# EAGLE design Low Noise PS (EAGLE 6.6.0)
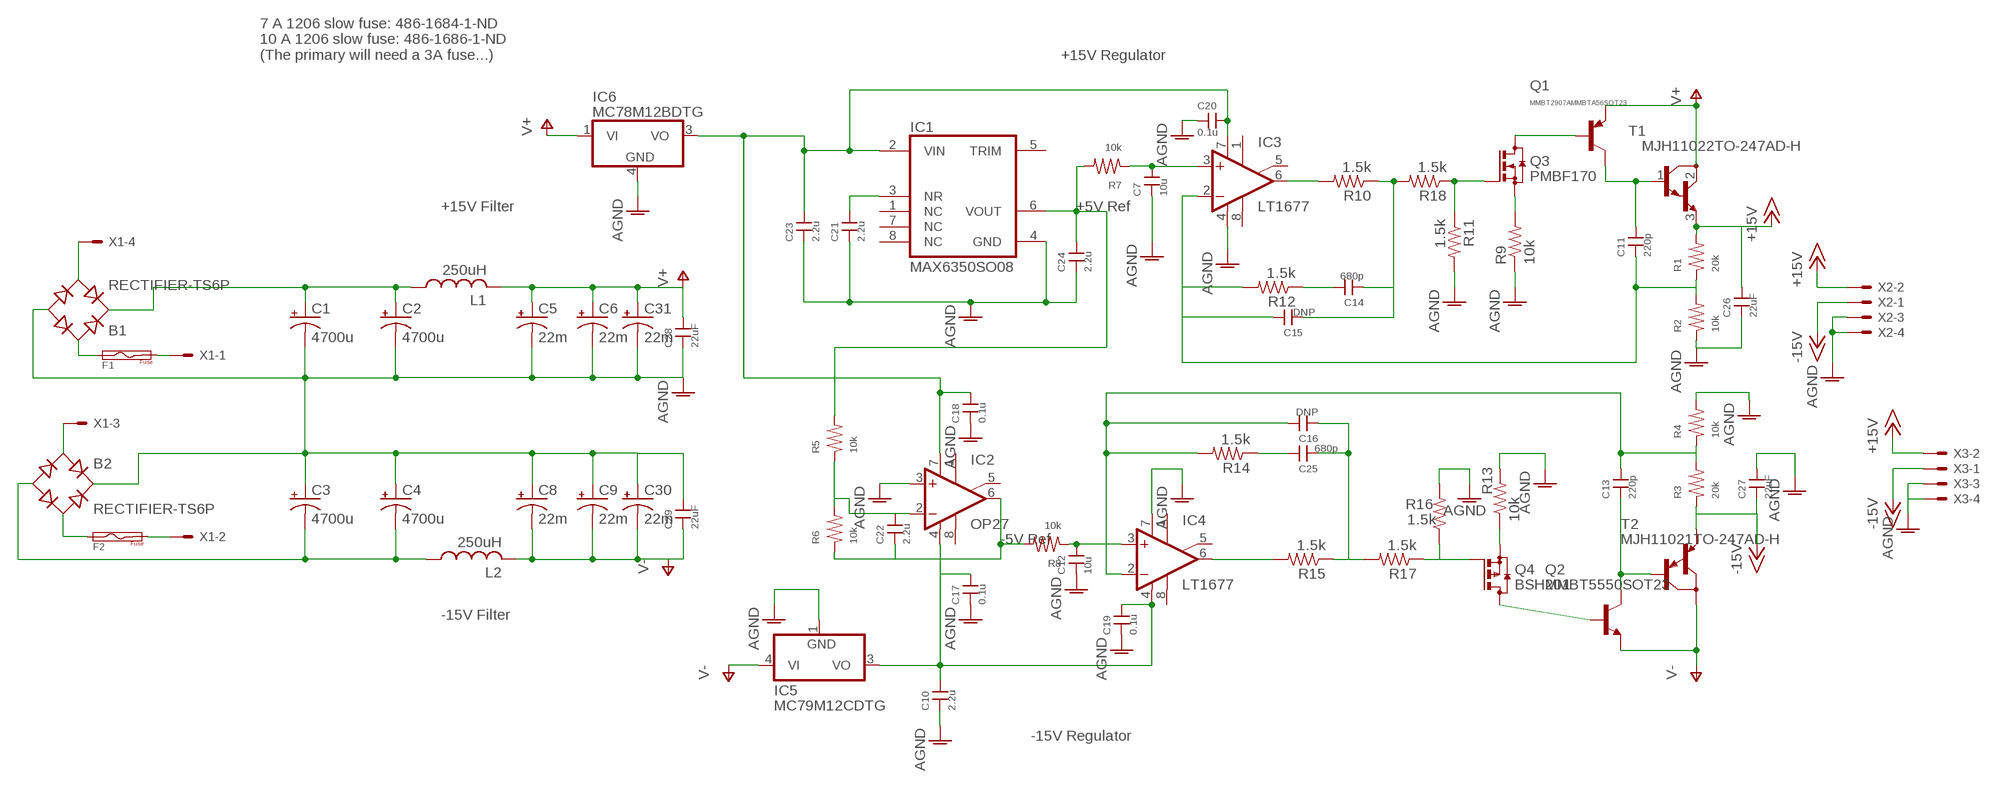
[diagram p0: schematic, sheet 1]

## Parts
B1  RECTIFIER-TS6P  [TS6P]
B2  RECTIFIER-TS6P  [TS6P]
C1  4700u  CPOL-USE7.5-18  [E7,5-18]
C2  4700u  CPOL-USE7.5-18  [E7,5-18]
C3  4700u  CPOL-USE7.5-18  [E7,5-18]
C4  4700u  CPOL-USE7.5-18  [E7,5-18]
C5  22m  CPOL-USEB35D  [EB35D]
C6  22m  CPOL-USEB35D  [EB35D]
C7  10u  CAP1206  [1206]
C8  22m  CPOL-USEB35D  [EB35D]
C9  22m  CPOL-USEB35D  [EB35D]
C10  2.2u  CAP1206  [1206]
C11  220p  CAP1206  [1206]
C12  10u  CAP1206  [1206]
C13  220p  CAP1206  [1206]
C14  680p  CAP1206  [1206]
C15  DNP  CAP1206  [1206]
C16  DNP  CAP1206  [1206]
C17  0.1u  CAP1206  [1206]
C18  0.1u  CAP1206  [1206]
C19  0.1u  CAP1206  [1206]
C20  0.1u  CAP1206  [1206]
C21  2.2u  CAP1206  [1206]
C22  2.2u  CAP1206  [1206]
C23  2.2u  CAP1206  [1206]
C24  2.2u  CAP1206  [1206]
C25  680p  CAP1206  [1206]
C26  22uF  CAP1206  [1206]
C27  22uF  CAP1206  [1206]
C28  22uF  CAP1206  [1206]
C29  22uF  CAP1206  [1206]
C30  22m  CPOL-USEB35D  [EB35D]
C31  22m  CPOL-USEB35D  [EB35D]
F1  FUSE1206  [FUSE1206]
F2  FUSE1206  [FUSE1206]
IC1  MAX6350SO08  [SO08]
IC2  OP27  OPAMP-SO  [SO08]
IC3  LT1677  OPAMP-SO  [SO08]
IC4  LT1677  OPAMP-SO  [SO08]
IC5  MC79M12CDTG  [DPACK_3]
IC6  MC78M12BDTG  [DPACK_3]
L1  250uH  INDUCTOR5721-RC  [5721-RC]
L2  250uH  INDUCTOR5721-RC  [5721-RC]
Q1  MMBT2907AMMBTA56SOT23  [SOT23]
Q2  MMBT5550SOT23  [SOT23]
Q3  PMBF170  [SOT23]
Q4  BSH201  [SOT23]
R1  20k  RES1206  [1206]
R2  10k  RES1206  [1206]
R3  20k  RES1206  [1206]
R4  10k  RES1206  [1206]
R5  10k  RES1206  [1206]
R6  10k  RES1206  [1206]
R7  10k  RES1206  [1206]
R8  10k  RES1206  [1206]
R9  10k  R-US_R1206  [R1206]
R10  1.5k  R-US_R1206  [R1206]
R11  1.5k  R-US_R1206  [R1206]
R12  1.5k  R-US_R1206  [R1206]
R13  10k  R-US_R1206  [R1206]
R14  1.5k  R-US_R1206  [R1206]
R15  1.5k  R-US_R1206  [R1206]
R16  1.5k  R-US_R1206  [R1206]
R17  1.5k  R-US_R1206  [R1206]
R18  1.5k  R-US_R1206  [R1206]
T1  MJH11022TO-247AD-H  [TO-247AD-H]
T2  MJH11021TO-247AD-H  [TO-247AD-H]
X1  5566-4RA  [5566-4-RA]
X2  5566-4RA  [5566-4-RA]
X3  5566-4RA  [5566-4-RA]

## Nets
+12V: C18.2 C20.2 C23.2 IC1.2(VIN) IC2.7(V+) IC3.7(V+) IC6.3(VO)
+15V: C26.2 R1.2 T1.3(E) X2.2 X3.2
-12V: C10.2 C17.2 C19.2 IC2.4(V-) IC4.4(V-) IC5.3(VO)
-15V: C27.1 R3.1 T2.3(E) X2.1 X3.1
AGND: B1.- B2.+ C1.- C2.- C3.+ C4.+ C5.- C6.- C7.1 C8.+ C9.+ C10.1 C12.1 C17.1 C18.1 C19.1 C20.1 C21.1 C23.1 C24.1 C26.1 C27.2 C28.1 C29.2 C30.+ C31.- IC1.4(GND) IC2.3(+IN) IC3.4(V-) IC4.7(V+) IC5.1(GND) IC6.4(GND) R2.1 R4.2 R9.1 R11.2 R13.2 R16.2 X2.3 X2.4 X3.3 X3.4
N$1: B1.AC1 F1.1
N$2: B1.AC2 X1.4
N$3: B1.+ C1.+ C2.+ L1.P$1
N$4: C21.2 IC1.3(NR)
N$5: F1.2 X1.1
N$6: B2.AC1 X1.3
N$7: C24.2 IC1.6(VOUT) R5.2 R7.2
N$8: B2.- C3.- C4.- L2.P$1
N$9: C14.2 R12.1
N$10: C13.1 Q2.3(C) T2.1(B)
N$11: IC3.6(OUT) R10.2
N$12: Q4.1(G) R16.1 R17.1
N$13: C11.2 Q1.3(C) T1.1(B)
N$14: C22.2 IC2.2(-IN) R5.1 R6.2
N$15: C22.1 IC2.6(OUT) R6.1 R8.2
N$16: Q4.2(S) R13.1
N$17: C11.1 C15.2 IC3.2(-IN) R1.1 R2.2 R12.2
N$18: IC4.6(OUT) R15.2
N$19: C7.2 IC3.3(+IN) R7.1
N$20: Q2.1(B) Q4.3(D)
N$21: C12.2 IC4.3(+IN) R8.1
N$22: F2.2 X1.2
N$23: C13.2 C16.2 IC4.2(-IN) R3.2 R4.1 R14.2
N$24: B2.AC2 F2.1
N$25: Q3.1(G) R11.1 R18.1
N$27: C25.2 R14.1
N$28: C16.1 C25.1 R15.1 R17.2
N$33: Q1.1(B) Q3.3(D)
N$34: Q3.2(S) R9.2
N$35: C14.1 C15.1 R10.1 R18.2
V+: C5.+ C6.+ C28.2 C31.+ IC6.1(VI) L1.P$2 Q1.2(E) T1.2(C)
V-: C8.- C9.- C29.1 C30.- IC5.4(VI) L2.P$2 Q2.2(E) T2.2(C)
Unconnected: IC1.1(NC) IC1.5(TRIM) IC1.7(NC) IC1.8(NC) IC2.1(ON1) IC2.5(ON2) IC2.8(OPT) IC3.1(ON1) IC3.5(ON2) IC3.8(OPT) IC4.1(ON1) IC4.5(ON2) IC4.8(OPT)

## Notes on the sheet
- 7 A 1206 slow fuse: 486-1684-1-ND
  10 A 1206 slow fuse: 486-1686-1-ND
  (The primary will need a 3A fuse...)
- +15V Regulator
- +15V Filter | +5V Ref
- -5V Ref
- -15V Filter
- -15V Regulator

## Library data of the parts
B1 B2 = jqi-power-supply:RECTIFIER-: Rectifier; DIGIKEY: DFB2005-ND
C1-C4 = jqi-power-supply:CPOL-US; DIGIKEY: 495-6089-ND
C5 C6 C8 C9 C30 C31 = jqi-power-supply:CPOL-US; DIGIKEY: 565-2880-ND
C7 C12 = rlc-jqi:CAP: SMT Capacitor; DIGIKEY: 445-12883-2-ND; VMAX: 50
C10 C21-C24 = rlc-jqi:CAP: SMT Capacitor; DIGIKEY: 587-2402-1-ND
C11 C13 = rlc-jqi:CAP: SMT Capacitor; DIGIKEY: 1276-1166-1-ND
C14 C25 = rlc-jqi:CAP: SMT Capacitor; DIGIKEY: 399-8209-1-ND
C15 C16 = rlc-jqi:CAP: SMT Capacitor
C17-C20 = rlc-jqi:CAP: SMT Capacitor; DIGIKEY: 399-1249-1-ND
C26-C29 = rlc-jqi:CAP: SMT Capacitor; DIGIKEY: 445-8045-1-ND
F1 F2 = jqi-power-supply:FUSE; DIGIKEY: 486-1686-1-ND
IC1 = jqi-power-supply:MAX6350: VOLATAGE REFERENCE; DIGIKEY: MAX6350CSA+-ND
IC2 = opamp-jqi:OPAMP: Basic Op Amp. Be sure to check actual pinout of your device, and modify as necessary!; DIGIKEY: OP27GSZ-REEL7CT-ND
IC3 IC4 = opamp-jqi:OPAMP: Basic Op Amp. Be sure to check actual pinout of your device, and modify as necessary!; DIGIKEY: LT1677CS8#PBF-ND
IC5 = linear:MC79M: 500 mA Negative Voltage Regulators Source: Data sheet <http://www.onsemi.com/pub_link/Collateral/MC79M00-D.PDF>; DIGIKEY: MC79M12CDTGOS-ND
IC6 = linear:MC78M: 500 mA Positive Voltage Regulators Source: Data sheet <http://www.onsemi.com/pub_link/Collateral/MC78M00-D.PDF>; DIGIKEY: MC78M12BDTGOS-ND
L1 L2 = jqi-power-supply:INDUCTOR; DIGIKEY: M8725-ND
Q1 = jqi-power-supply:MMBT2907A: PNP Transistor; DIGIKEY: MMBT2907AFSCT-ND
Q2 = jqi-power-supply:MMBT5550: NPN Transistor; DIGIKEY: MMBT5550CT-ND
Q3 = jqi-power-supply:PMBF170: N-CHANNEL MOS FET; DIGIKEY: MMBT2907AFSCT-ND
Q4 = jqi-power-supply:BSH201: P-CHANNEL MOS FET; DIGIKEY: 568-6217-1-ND
R1 R3 = rlc-jqi:RES: SMT Resistor; DIGIKEY: RMCF1206FT20K0CT-ND
R2 R4-R8 = rlc-jqi:RES: SMT Resistor; DIGIKEY: RNCP1206FTD10K0CT-ND
R9 R13 = rcl:R-US_: RESISTOR, American symbol; DIGIKEY: RNCP1206FTD10K0CT-ND
R10-R12 R14-R18 = rcl:R-US_: RESISTOR, American symbol; DIGIKEY: 541-1.5KECT-ND
T1 = jqi-power-supply:MJH11022: NPN POWER DARLINGTON TRANSISTOR 15A, 250V; DIGIKEY: MJH11022GOS-ND
T2 = jqi-power-supply:MJH11021: PNP POWER DARLINGTON TRANSISTOR 15A, 250V; DIGIKEY: MJH11021GOS-ND
X1-X3 = jqi-power-supply:5566-4: Mini FIT connector 4 pol Source: http://www.molex.com; DIGIKEY: WM1352-ND

## Board
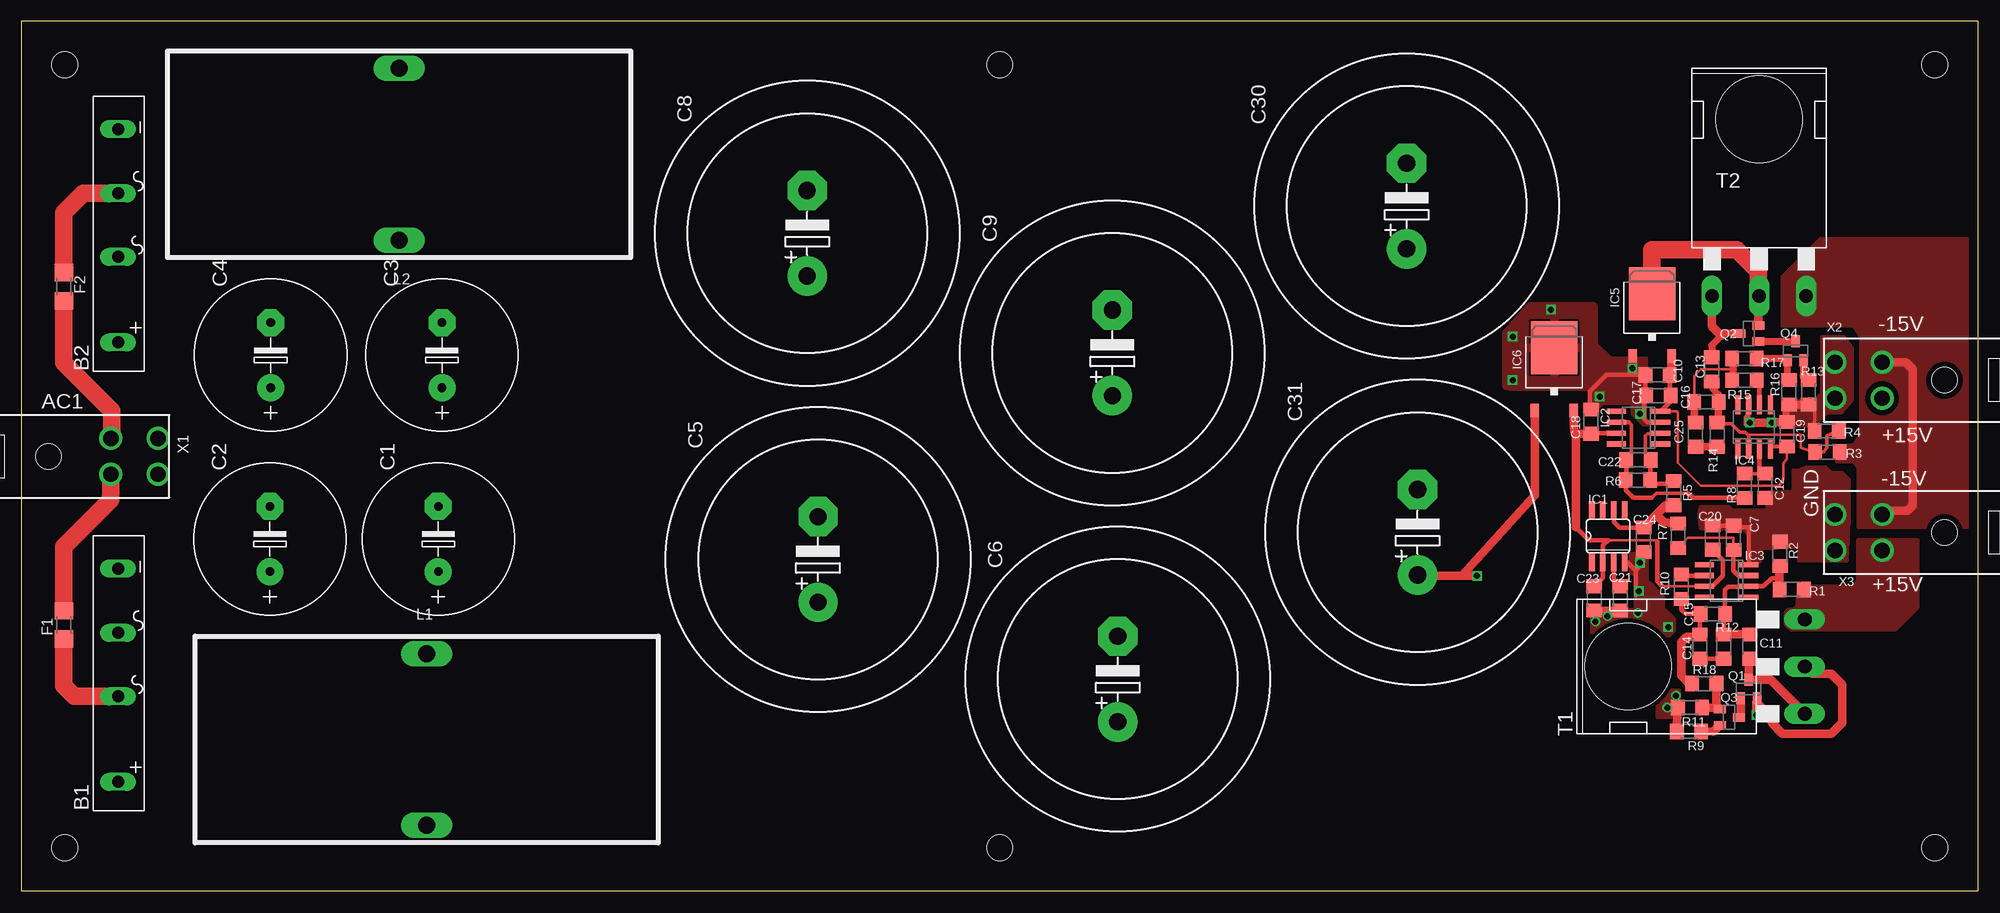
[diagram p1: board, top side]
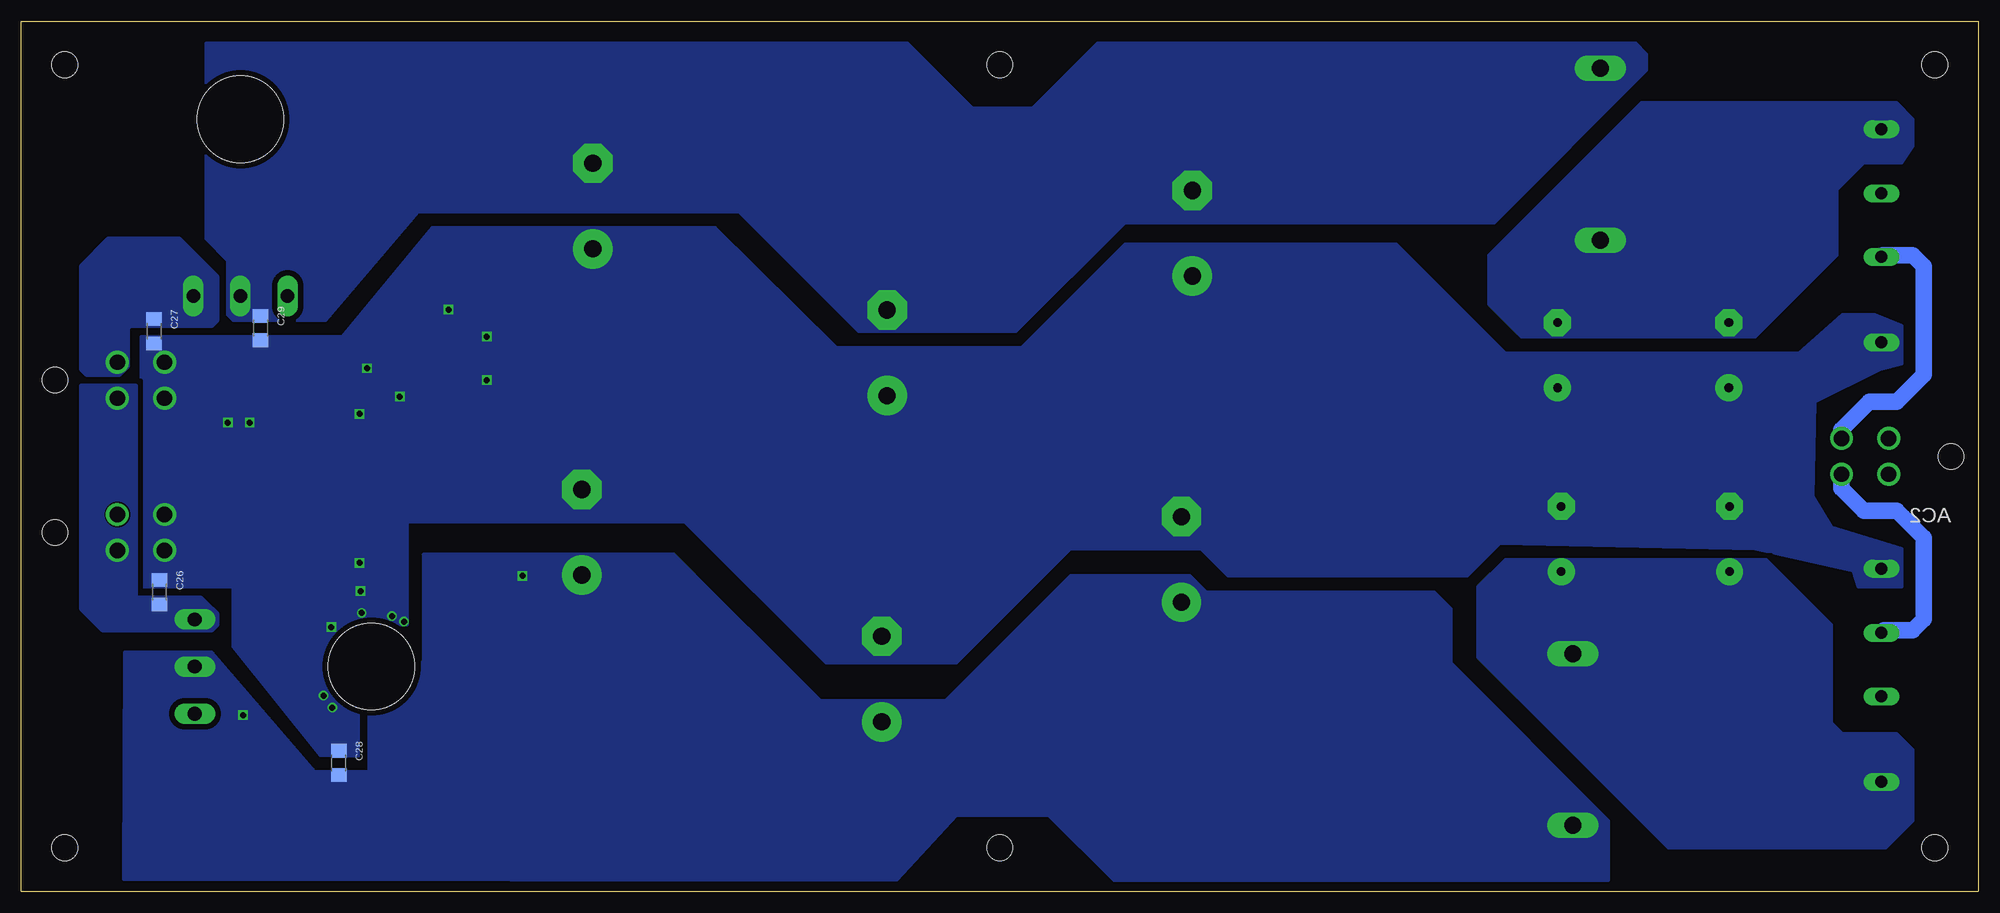
[diagram p2: board, bottom side, seen from below]

Size 228.6 x 101.6 mm. Coordinates in mm from the lower left corner, seen from the top.
Outline: 228.6,0 228.6,101.6 0,101.6 0,0 228.6,0
Copper layers (1+2*15+16): Top 0.0178mm / dielectric 12mil / Route2 0.0356mm / dielectric 28mil / Route15 0.0356mm / dielectric 12mil / Bottom 0.0178mm
Design rules "SSC-EAGLE-4Lyr_v1.0.0.3": minimum track width 6mil, minimum drill 8mil, track to track 6mil, track to pad 6mil, pad to pad 6mil, via to via 6mil, smd to smd 6mil, copper to edge 20mil, drill to drill 16mil, minimum pad ring 8mil, minimum via ring 8mil, stop-mask expansion 3mil, vias tented up to drill 0mil, thermal gap 10mil
Holes 3.05 mm at 223.52,5.08 223.52,96.52 5.08,96.52 5.08,5.08 114.3,96.52 114.3,5.08

### Footprints (pad centres in the part's own frame; a part is rotated, then mirrored left to right if it is on the bottom)
TS6P = drill 1.397 long: + -13.7,0; - 11.2,0; AC1 -3.7,0; AC2 3.7,0
E7,5-18 = drill 1.016 pad 3.15: + -3.81,0 | drill 1.016 pad 3.15 octagon: - 3.81,0
EB35D = drill 2.007 pad 4.597: + -5,0 | drill 2.007 pad 4.597 octagon: - 5,0
1206 = smd 1.6 x 1.803: 1 -1.422,0; 2 1.422,0
FUSE1206 = smd 2.032 x 2.159: 1 -1.651,0; 2 1.651,0
SO08 = smd 0.66 x 2.032: 1 -1.905,-3.073; 2 -0.635,-3.073; 3 0.635,-3.073; 4 1.905,-3.073; 5 1.905,3.073; 6 0.635,3.073; 7 -0.635,3.073; 8 -1.905,3.073
SO08' = smd 2.2 x 0.6: 1 -2.6,1.27; 2 -2.6,0; 3 -2.6,-1.27; 4 -2.6,-2.54; 5 2.6,-2.54; 6 2.6,-1.27; 7 2.6,0; 8 2.6,1.27
DPACK_3 = smd 1 x 1.6: 1 -2.28,-4.8; 3 2.28,-4.8 | smd 5.4 x 6.2: 4 0,2.5
5721-RC = drill 2 long: P$1 0,10.033; P$2 0,-10.033
SOT23 = smd 1 x 1.4: 1 -0.95,-1.1; 2 0.95,-1.1; 3 0,1.1
R1206 = smd 1.6 x 1.803: 1 -1.422,0; 2 1.422,0
TO-247AD-H = drill 1.6 long: 1 -5.5,-20.65; 2 0,-20.65; 3 5.5,-20.65 | hole 10.16: 0,0
5566-4-RA = drill 1.778: 1 2.095,-2.756; 2 -2.095,-2.756; 3 -2.095,2.756; 4 2.095,2.756 | hole 3: 0,-10.046

### Placement (x,y rotation side)
B1  11.3,26.48 90 top
B2  11.3,77.81 90 top
C1  48.7,41.15 90 top
C2  29.04,41.15 90 top
C3  49.14,62.61 90 top
C4  29.12,62.61 90 top
C5  93.06,38.76 90 top
C6  128.09,24.79 90 top
C7  200.03,41.27 270 top
C8  91.8,76.86 90 top
C9  127.45,62.88 90 top
C10  191.13,60.33 0 top
C11  201.93,28.57 270 top
C12  203.71,47.37 90 top
C13  197.49,60.96 270 top
C14  196.09,28.57 270 top
C15  197.61,32.38 0 top
C16  196.85,57.15 0 top
C17  191.24,57.9 0 top
C18  183.38,54.85 270 top
C19  206.28,53.38 270 top
C20  197.56,41.3 270 top
C21  186.78,34.21 90 top
C22  188.91,50.4 0 top
C23  183.76,34.21 90 top
C24  189.5,41.05 90 top
C25  195.58,53.34 270 top
C26  212.47,34.92 270 bottom
C27  213.11,65.41 270 bottom
C28  191.52,14.99 270 bottom
C29  200.66,65.79 270 bottom
C30  161.84,80.03 90 top
C31  163.12,41.94 90 top
F1  4.95,31.11 90 top
F2  4.95,70.61 270 top
IC1  185.38,41.49 0 top
IC2  OP27  [SO08']  188.92,53.51 180 top
IC3  LT1677  [SO08']  199.21,35.61 180 top
IC4  LT1677  [SO08']  201.78,54.23 90 top
IC5  190.5,67.31 0 top
IC6  179.07,60.96 0 top
L1  47.34,17.73 0 top
L2  44.13,86.08 180 top
Q1  201.8,23.62 0 top
Q2  201.8,65.15 90 top
Q3  199.52,20.32 270 top
Q4  207.26,63.12 0 top
R1  206.82,35.26 0 top
R2  205.44,39.4 270 top
R3  210.98,51.29 180 top
R4  210.91,53.76 180 top
R5  193.04,46.5 270 top
R6  188.84,48.01 0 top
R7  193.55,41.53 90 top
R8  201.29,47.37 270 top
R9  194.82,18.67 0 top
R10  193.93,35.56 90 top
R11  194.94,21.46 180 top
R12  198.88,28.57 90 top
R13  208.79,58.29 270 top
R14  198.12,53.34 90 top
R15  201.29,59.69 0 top
R16  206.5,58.29 270 top
R17  201.29,62.23 180 top
R18  196.6,24.26 180 top
T1  187.7,26.25 90 top
T2  203.02,90.17 0 top
X1  13.21,50.8 270 top
X2  214.63,59.69 90 top
X3  214.63,41.91 90 top

### Tracks (layer width: path | path; a pad name or v marks a point on that pad's centre or on a via)
+12V
  Top 0.305: IC3.7 191.72,35.61 | 191.13,40.89 191.01,41.02 185.42,41.02
  Top 0.508: C20.2 198.75,38.68 198.75,36.83 197.49,35.56 197.44,35.61 IC3.7 | 183.7,35.69 C23.2 184.75,36.62 IC1.2 184.78,38.46 184.78,40.39 185.42,41.02 183.13,41.02 181.61,42.55 | IC2.7 183.46,53.51 C18.2 | 191.72,35.61 191.13,36.2 191.13,40.89
  Top 1.016: IC6.3 181.36,54.99 181.36,54.23 181.48,53.47 181.61,53.47 | 181.61,53.47 183.35,53.47 C18.2 | 181.61,42.55 181.61,53.47
+15V
  pour Top (no thermals): 208.28,34.29 208.28,35.56 214,35.56 214.63,36.2 214.63,41.02 221.49,41.02 221.49,33.15 218.95,30.61 206.76,30.61 206.5,30.86 206.12,31.24 206.12,32.51 206.5,32.89 207.14,32.89 207.52,33.27 207.52,34.16 207.65,34.29
  pour Bottom (no thermals): 215.26,59.05 221.62,59.05 221.62,33.02 219.07,30.48 206.38,30.48 205.74,31.11 205.74,32.38 207.01,33.66 207.65,34.29 215.26,34.29
-12V
  Top 0.305: C19.2 206.25,50.55 205.87,49.91 205.87,48.13 205.36,47.37 196.22,47.37 193.55,50.04 193.55,55.88 193.38,56.05 IC2.4
  Top 0.508: 206.09,51.63 C19.2 204.34,51.94 IC4.4 | IC2.4 192.66,57.19 C17.2 192.56,58 C10.2
  Top 1.016: IC5.3 192.79,60.83 192.56,60.83 C10.2
-15V
  Top 1.016: X2.1 220.16,61.78 220.98,60.96 220.98,45.09 220.34,44.45 217.83,44.45 X3.1
  pour Bottom (no thermals): 205.74,66.67 205.74,71.75 210.19,76.2 218.44,76.2 221.62,73.03 221.62,60.96 220.98,60.33 217.17,60.33 216.53,60.96 216.15,61.34 216.15,65.79 215.9,66.04 206.38,66.04
  pour Top (isolate 0.635, no thermals): 212.09,52.07 214,52.07 214.88,53.34 214.88,64.77 214,66.04 205.74,66.04 205.74,71.75 210.19,76.2 227.33,76.2 227.33,42.55 214.63,42.55 214.63,49.53 214,50.16 212.09,50.16
AGND  (via drill 0.7)
  Top 0.406: 208.5,56.84 209.55,56.01 R4.2 | 201.8,54.74 201.55,54.36 201.42,54.48 201.42,55.37 201.68,55.75
  Top 0.508: 204.66,54.8 v204.47,54.74 | IC4.7 201.78,55.65 201.8,54.74 | C20.1 197.58,42.7 C7.1 200.18,42.55 201.93,42.55 201.81,42.42 201.81,39.37 | 201.81,39.37 IC3.4 | 201.93,39.24 201.81,39.37 | IC1.4 187.64,38.42 188.59,37.47 | 188.59,37.47 188.59,34.6 | C24.1 189.5,38.5 188.59,37.47 | IC2.3 189.95,54.78 189.61,55.12 189.61,57.69 C17.1 189.71,58 C10.1 185.17,60.33 183.26,58.42 183.26,56.4 C18.1
  Top 0.813: C19.1 206.15,56.84 R16.2
  Top 1.016: C19.1 204.66,54.8 | 201.8,54.74 v204.47,54.74 | 206.15,56.84 208.5,56.84 R13.2 | R9.1 193.45,21.36 v192.28,21.46 R11.2 | C23.1 C21.1
  other vias: 201.93,54.74 184.4,57.78 188.21,61.09 189.1,55.75 193.29,22.86 174.24,59.69 174.24,64.77 178.69,67.94 189.1,38.35 183.9,31.5 185.29,32.13 188.85,32.51 188.98,35.05 192.41,30.86
  pour Bottom (isolate 0.635, rank 2, no thermals): 17.14,42.55 19.3,46.1 19.05,57.15 11.43,60.96 8.89,61.59 8.89,66.04 12.06,67.31 15.88,67.31 20.95,62.87 55.24,62.87 67.94,75.56 99.69,75.56 111.76,63.5 133.35,63.5 147.57,77.47 180.59,77.47 191.13,64.77 214.63,64.77 214.63,35.56 203.84,35.56 203.84,28.57 193.68,15.88 189.23,15.75 189.23,31.11 183.51,31.11 183.51,43.18 151.13,43.18 134.62,26.67 119.38,26.67 106.05,40.01 90.81,40.01 87.63,36.83 59.69,36.83 55.88,40.64 26.04,40.01 14.61,37.47 13.97,35.56 8.89,35.56 8.89,40.01
  pour Top (no thermals): 202.95,46.61 204.98,46.61 207.01,46.74 207.01,49.15 207.65,49.15 208.53,49.53 210.82,49.53 211.46,48.9 212.72,48.9 213.49,48.13 213.49,43.31 213.23,38.61 207.65,38.61 207.65,40.13 203.96,40.26 203.96,46.23
  pour Top (no thermals): 206.38,57.02 206.25,54.36 209.42,54.36 210.95,55.88 212.6,55.88 213.87,57.28 213.87,63.5 212.98,64.77 210.31,64.77 210.31,58.17 209.68,57.53 208.79,57.53
  pour Top (no thermals): 183.51,56.52 183.51,58.42 186.69,62.23 189.87,62.23 189.87,57.66 189.48,57.28 189.48,55.37 189.99,54.86 189.99,54.48 189.48,54.48 188.21,55.75 188.21,56.9 188.09,57.02 184.78,57.02 184.28,56.52
  pour Top (no thermals): 205.1,40.64 205.1,40.13 203.45,40.13 203.07,39.75 203.07,38.61 202.69,38.23 201.93,38.23 201.93,41.66 201.17,42.42 196.22,42.42 196.09,43.81 196.09,44.07 196.22,44.83 199.39,44.83 199.77,44.45 204.72,44.45 204.72,41.02
  pour Top (no thermals): 192.41,20.32 191.13,20.32 191.13,23.5 193.68,23.5 193.68,20.32
  pour Top: 187.71,61.98 185.55,61.98 183.64,63.75 183.64,68.33 176.28,68.33 173.48,65.15 173.48,59.05 173.99,58.93 184.66,58.93
  pour Top (no thermals): 183.51,33.02 183.51,28.57 191.77,28.57 191.77,29.21 193.04,30.48 193.04,31.75 191.77,33.02 191.77,34.29 190.25,35.94 189.87,36.2 189.87,39.37 188.09,39.37 188.09,37.34 188.59,36.83 188.59,34.42 188.59,33.27 188.59,32.89 183.9,32.77
N$1
  Top 2.032: B1.AC1 6.18,22.77 4.95,24 F1.1
N$2
  Bottom 1.93: X1.4 15.96,47.08 13.34,44.45 9.53,44.45 6.35,41.27 6.35,31.75 7.62,30.48 11,30.48 B1.AC2
N$3
  pour Bottom (no thermals): 7.62,14.61 7.62,16.51 9.53,18.41 15.88,18.41 17.14,19.68 17.14,31.11 24.77,38.73 55.24,38.73 58.42,35.56 58.42,27.3 36.2,5.08 10.79,5.08 7.62,8.26
N$4
  Top 0.508: IC1.3 186.02,36.4 C21.2
N$5
  Top 2.032: F1.2 4.95,40.26 10.41,45.72 10.41,48.67 X1.1
N$6
  Bottom 1.93: X1.3 15.96,53.89 12.7,57.15 9.53,57.15 6.35,60.33 6.35,73.03 7.62,74.3 11.11,74.3 B2.AC1
N$7
  Top 0.508: C24.2 186.76,42.47 186.06,43.18 186.06,44.52 IC1.6
  Top 1.016: R5.2 192.11,45.08 190.99,43.96 | 190.99,43.96 C24.2 | R7.2 191.87,43.08 190.99,43.96
N$8
  pour Bottom (no thermals): 7.62,90.17 9.53,92.08 39.37,92.08 57.15,74.3 57.15,68.58 53.34,64.77 26.04,64.77 16.51,74.3 16.51,81.92 13.34,85.09 8.89,85.09 7.62,87
N$9
  Top 0.508: C14.2 R12.1
N$10
  Top 0.813: Q2.3 198.88,65.15 198.63,64.9 197.49,63.75 C13.1
  Top 1.016: T2.1 197.52,66.01 198.63,64.9
N$11
  Top 0.508: IC3.6 196.58,36.85 193.93,36.85 R10.2
N$12
  Top 0.762: R16.1 206.31,59.72 Q4.1
  Top 0.813: 206.12,61.83 Q4.1 206.1,62.23 R17.1
N$13
  Top 1.016: C11.2 201.8,27.03 Q1.3 204.37,24.72 T1.1
N$14
  Top 0.406: C22.2 190.33,50.46 189.74,51.05 189.74,53.21 189.99,53.47 191.48,53.47 IC2.2
  Top 0.508: C22.2 190.33,48.08 R6.2 190.5,47.78 190.5,47.62 192.23,47.62 R5.1
N$15
  Top 0.381: 194.69,46.48 191.01,46.48 190.5,45.97
  Top 0.406: 187.32,50.56 187.34,50.56 188.09,51.31 188.09,54.48 187.79,54.78
  Top 0.508: 187.09,50.8 187.32,50.56 C22.1 187.49,48.08 R6.1 187.45,47.98 187.45,46.86 188.34,45.97 190.5,45.97 | IC2.6 187.79,54.78 | R8.2 195.35,45.95 194.69,46.48
N$16
  Top 0.813: R13.1 208.21,60.03 Q4.2
N$17
  Top 0.508: R12.2 198.88,32.23 C15.2 199.03,35.2 199.39,35.56 201.75,35.56 IC3.2 203.5,35.61 204.47,36.58 205.39,36.58
  Top 1.016: R2.2 205.39,37.98 205.39,36.58 R1.1 | R12.2 C11.1
N$18
  Top 0.508: IC4.6 203.05,59.36 R15.2
N$19
  Top 0.305: C7.2 200.03,41.27 194.72,41.27 R7.1
  Top 0.508: IC3.3 200.61,36.88 200.03,37.47 C7.2
N$20
  Top 0.813: Q4.3 207.25,64.2 Q2.1
N$21
  Top 0.406: R8.1 C12.2
  Top 0.508: 203.71,49.02 203.05,49.55 IC4.3
  Top 0.813: C12.2 203.71,49.02
N$22
  Top 2.032: F2.2 4.95,61.72 10.54,56.13 10.54,52.98 X1.2
N$23
  Top 0.305: 201.8,53.21 201.93,53.34 207.9,53.34 207.9,51.82 208.91,51.44
  Top 0.406: 198.27,54.61 199.77,54.61 200.79,53.59 201.42,53.59 201.8,53.21 201.8,51.66 IC4.2 | 209.41,51.44 R3.2 | 208.91,51.44 R3.2 | R3.2 210.57,51.31 210.95,51.82 210.95,53.21 R4.1
  Top 0.508: 198.27,54.61 R14.2
  Top 0.813: C13.2 197.61,59.41 197.61,58.67 198.27,58.01 C16.2
  Top 0.889: C16.2 198.27,54.91 R14.2
N$24
  Top 2.032: B2.AC2 7.21,81.5 4.95,79.25 F2.1
N$25
  Top 1.016: R18.1 198.02,21.67 | 198.02,21.67 Q3.1 | R11.1 197.81,21.46 198.02,21.67
N$27
  Top 0.889: R14.1 C25.2
N$28
  Top 0.305: 200.03,60.96 196.22,60.96 195.43,60.17 C16.1
  Top 0.813: R15.1 200.03,59.84 200.03,60.96 200.03,62.08 R17.2
  Top 0.889: C16.1 195.43,54.91 C25.1
N$33
  Top 1.016: Q1.1 200.85,20.56 Q3.3
N$34
  Top 1.016: R9.2 197.69,18.64 Q3.2
N$35
  Top 0.508: R10.1 193.93,32.89 194.44,32.38 C15.1 196.09,32.28 C14.1
  Top 1.016: R18.2 194.82,24.26 193.93,25.15 193.93,29.08 194.56,29.72 195.81,29.72 C14.1
V+  (via drill 0.7)
  Top 1.016: Q1.2 202.75,22.04 204.47,20.32 204.47,19.68 205.74,18.41 211.46,18.41 212.72,19.68 212.72,24.13 211.46,25.4 209.19,25.4 T1.2 | v202.69,20.57 202.69,22.1 202.82,22.23 | IC6.1 176.79,46.23 168.28,36.83 | 168.28,36.83 163.22,36.83 C31.+ | v170.05,36.83 168.28,36.83
  pour Bottom (isolate 0.635, no thermals): 43.18,8.26 61.59,26.67 61.59,33.02 63.5,34.92 90.17,34.92 92.08,36.83 106.05,36.83 120.65,22.23 135.25,22.23 152.4,39.37 181.61,39.37 181.61,26.67 187.96,26.67 187.96,13.97 194.31,13.97 206.38,27.94 216.53,27.94 216.66,1.4 126.36,1.27 119.38,8.89 108.58,8.89 100.97,1.27 43.18,1.27
V-
  Top 1.016: Q2.2 202.9,69.41 T2.2
  Top 2.032: IC5.4 190.5,74.93 200.41,74.93 202.95,72.39 202.95,69.59 T2.2
  pour Bottom (isolate 0.635, no thermals): 40.01,99.06 102.87,99.06 110.49,91.44 117.47,91.44 125.09,99.06 207.01,99.06 207.01,76.2 204.47,73.66 204.47,67.31 203.84,66.67 193.04,66.67 182.25,79.38 144.78,79.38 130.81,65.41 112.39,65.41 99.69,78.11 56.52,78.11 38.73,95.89 38.73,97.79

### Text on the board
tNames: -15V | AC1 | +15V | -15V | GND | +15V
bNames: AC2